# EAGLE schematic Main (EAGLE 9.5.1)

## Sheet 1 of 2
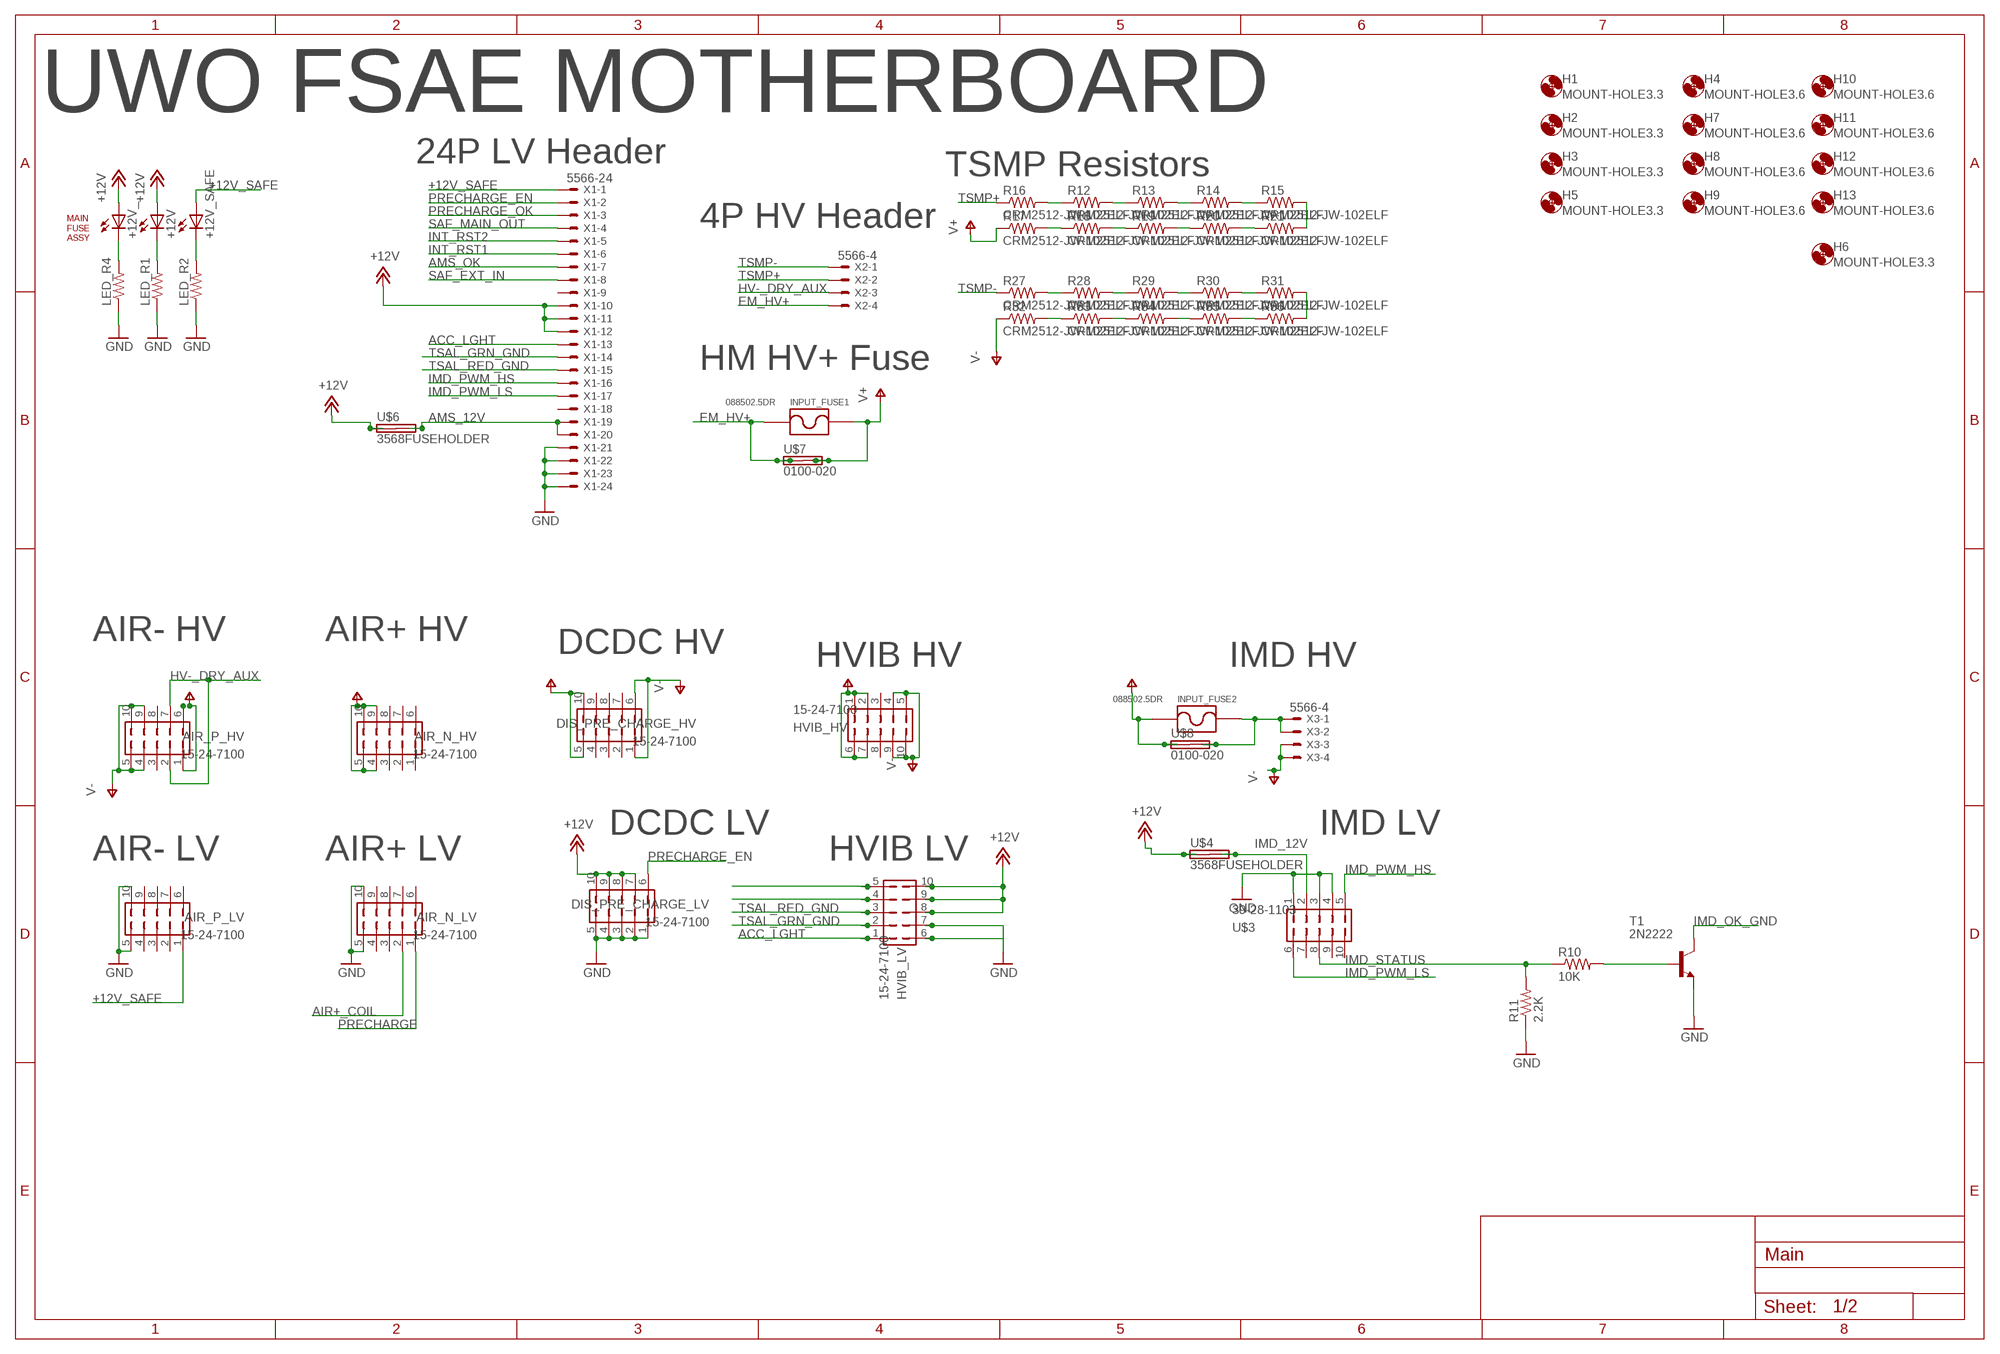
[diagram p0: schematic, sheet 1]

### Parts
+12V  LED3MM  [LED3MM]
+12V_  LED3MM  [LED3MM]
+12V_SAFE  LED3MM  [LED3MM]
AIR_N_HV  15-24-7100  [5566-10-BMI]
AIR_N_LV  15-24-7100  [5566-10-BMI]
AIR_P_HV  15-24-7100  [5566-10-BMI]
AIR_P_LV  15-24-7100  [5566-10-BMI]
DIS_PRE_CHARGE_HV  15-24-7100  [5566-10-BMI]
DIS_PRE_CHARGE_LV  15-24-7100  [5566-10-BMI]
H1  MOUNT-HOLE3.3  [3,3]
H2  MOUNT-HOLE3.3  [3,3]
H3  MOUNT-HOLE3.3  [3,3]
H4  MOUNT-HOLE3.6  [3,6]
H5  MOUNT-HOLE3.3  [3,3]
H6  MOUNT-HOLE3.3  [3,3]
H7  MOUNT-HOLE3.6  [3,6]
H8  MOUNT-HOLE3.6  [3,6]
H9  MOUNT-HOLE3.6  [3,6]
H10  MOUNT-HOLE3.6  [3,6]
H11  MOUNT-HOLE3.6  [3,6]
H12  MOUNT-HOLE3.6  [3,6]
H13  MOUNT-HOLE3.6  [3,6]
HVIB_HV  15-24-7100  [5566-10-BMI]
HVIB_LV  15-24-7100  [5566-10-BMI]
INPUT_FUSE1  088502.5DR  _CUSTOM_PARTS_LF_885  [_CUSTOM_PARTS_LF_885]
INPUT_FUSE2  088502.5DR  _CUSTOM_PARTS_LF_885  [_CUSTOM_PARTS_LF_885]
LED_R1  R-US_R0805  [R0805]
LED_R2  R-US_R0805  [R0805]
LED_R4  R-US_R0805  [R0805]
R10  10K  R-US_M0805  [M0805]
R11  2.2K  R-US_M0805  [M0805]
R12  CRM2512-JW-102ELF  R-US_R2512  [R2512]
R13  CRM2512-JW-102ELF  R-US_R2512  [R2512]
R14  CRM2512-JW-102ELF  R-US_R2512  [R2512]
R15  CRM2512-JW-102ELF  R-US_R2512  [R2512]
R16  CRM2512-JW-102ELF  R-US_R2512  [R2512]
R17  CRM2512-JW-102ELF  R-US_R2512  [R2512]
R18  CRM2512-JW-102ELF  R-US_R2512  [R2512]
R19  CRM2512-JW-102ELF  R-US_R2512  [R2512]
R20  CRM2512-JW-102ELF  R-US_R2512  [R2512]
R21  CRM2512-JW-102ELF  R-US_R2512  [R2512]
R27  CRM2512-JW-102ELF  R-US_R2512  [R2512]
R28  CRM2512-JW-102ELF  R-US_R2512  [R2512]
R29  CRM2512-JW-102ELF  R-US_R2512  [R2512]
R30  CRM2512-JW-102ELF  R-US_R2512  [R2512]
R31  CRM2512-JW-102ELF  R-US_R2512  [R2512]
R32  CRM2512-JW-102ELF  R-US_R2512  [R2512]
R33  CRM2512-JW-102ELF  R-US_R2512  [R2512]
R34  CRM2512-JW-102ELF  R-US_R2512  [R2512]
R35  CRM2512-JW-102ELF  R-US_R2512  [R2512]
R36  CRM2512-JW-102ELF  R-US_R2512  [R2512]
T1  2N2222  [TO92-EBC-OVAL]
U$1  MAINFUSEASSY  [MAINFUSEASSY]
U$3  39-28-1103  [39-28-1103]
U$4  3568FUSEHOLDER  [3568]
U$6  3568FUSEHOLDER  [3568]
U$7  0100-020  [0100-020]
U$8  0100-020  [0100-020]
X1  5566-24  [5566-24]
X2  5566-4  [5566-4]
X3  5566-4  [5566-4]

### Nets
+12V: +12V.A +12V_.A DIS_PRE_CHARGE_LV.7 DIS_PRE_CHARGE_LV.8 DIS_PRE_CHARGE_LV.9 DIS_PRE_CHARGE_LV.10 HVIB_LV.8 HVIB_LV.9 HVIB_LV.10 U$4.L1(1A) U$4.L2(1B) U$6.L1(1A) U$6.L2(1B) X1.10 X1.11 X1.12 ; also sheet 2
+12V_SAFE: +12V_SAFE.A AIR_P_LV.1 X1.1 ; also sheet 2
ACC_LGHT: HVIB_LV.1 X1.13
AIR+_COIL: AIR_N_LV.2 ; also sheet 2
AMS_12V: U$6.R1(2A) U$6.R2(2B) X1.19 X1.20
AMS_OK: X1.7 ; also sheet 2
EM_HV+ [HV]: INPUT_FUSE1.P$1 U$7.P$1(1A) U$7.P$3(1B) X2.4
GND: AIR_N_LV.5 AIR_N_LV.10 AIR_P_LV.5 AIR_P_LV.10 DIS_PRE_CHARGE_LV.1 DIS_PRE_CHARGE_LV.2 DIS_PRE_CHARGE_LV.3 DIS_PRE_CHARGE_LV.4 DIS_PRE_CHARGE_LV.5 HVIB_LV.7 LED_R1.1 LED_R2.1 LED_R4.1 R11.1 T1.E U$3.1 U$3.3 U$3.4 X1.21 X1.22 X1.23 X1.24 ; also sheet 2
HV-_DRY_AUX [HV]: AIR_P_HV.2 AIR_P_HV.7 X2.3
IMD_12V: U$3.2 U$4.R1(2A) U$4.R2(2B)
IMD_OK_GND: T1.C ; also sheet 2
IMD_PWM_HS: U$3.5 X1.16
IMD_PWM_LS: U$3.6 X1.17
IMD_STATUS: R10.1 R11.2 U$3.8
INT_RST1: X1.6 ; also sheet 2
INT_RST2: X1.5 ; also sheet 2
N$1: HVIB_LV.6
N$2: +12V.K(C) LED_R1.2
N$3: R10.2 T1.B
N$5: +12V_.K(C) LED_R4.2
N$6: +12V_SAFE.K(C) LED_R2.2
N$10: R12.1 R16.2
N$12: HVIB_LV.4
N$16: HVIB_LV.5
N$17: R12.2 R13.1
N$18: R13.2 R14.1
N$19: R14.2 R15.1
N$20 [HV]: R15.2 R21.2
N$21 [HV]: R20.2 R21.1
N$22 [HV]: R19.2 R20.1
N$23 [HV]: R18.2 R19.1
N$24 [HV]: R17.2 R18.1
N$26: INPUT_FUSE2.P$2 U$8.P$2(2A) U$8.P$4(2B) X3.1 X3.2
N$32 [HV]: R27.2 R28.1
N$33 [HV]: R28.2 R29.1
N$34 [HV]: R29.2 R30.1
N$35 [HV]: R30.2 R31.1
N$36 [HV]: R31.2 R36.2
N$37 [HV]: R35.2 R36.1
N$38 [HV]: R34.2 R35.1
N$39 [HV]: R33.2 R34.1
N$40 [HV]: R32.2 R33.1
PRECHARGE: AIR_N_LV.1 ; also sheet 2
PRECHARGE_EN: DIS_PRE_CHARGE_LV.6 X1.2 ; also sheet 2
PRECHARGE_OK: X1.3 ; also sheet 2
SAF_EXT_IN: X1.8 ; also sheet 2
SAF_MAIN_OUT: X1.4 ; also sheet 2
TSAL_GRN_GND: HVIB_LV.2 X1.14
TSAL_RED_GND: HVIB_LV.3 X1.15
TSMP+ [HV]: R16.1 X2.2
TSMP- [HV]: R27.1 X2.1
V+ [HV]: AIR_N_HV.4 AIR_N_HV.5 AIR_N_HV.9 AIR_N_HV.10 AIR_P_HV.1 AIR_P_HV.6 DIS_PRE_CHARGE_HV.5 DIS_PRE_CHARGE_HV.10 HVIB_HV.1 HVIB_HV.2 HVIB_HV.6 HVIB_HV.7 INPUT_FUSE1.P$2 INPUT_FUSE2.P$1 R17.1 U$7.P$2(2A) U$7.P$4(2B) U$8.P$1(1A) U$8.P$3(1B)
V- [HV]: AIR_P_HV.4 AIR_P_HV.5 AIR_P_HV.9 AIR_P_HV.10 DIS_PRE_CHARGE_HV.1 DIS_PRE_CHARGE_HV.6 HVIB_HV.4 HVIB_HV.5 HVIB_HV.9 HVIB_HV.10 R32.1 X3.3 X3.4
Unconnected: AIR_N_HV.1 AIR_N_HV.2 AIR_N_HV.3 AIR_N_HV.6 AIR_N_HV.7 AIR_N_HV.8 AIR_N_LV.3 AIR_N_LV.4 AIR_N_LV.6 AIR_N_LV.7 AIR_N_LV.8 AIR_N_LV.9 AIR_P_HV.3 AIR_P_HV.8 AIR_P_LV.2 AIR_P_LV.3 AIR_P_LV.4 AIR_P_LV.6 AIR_P_LV.7 AIR_P_LV.8 AIR_P_LV.9 DIS_PRE_CHARGE_HV.2 DIS_PRE_CHARGE_HV.3 DIS_PRE_CHARGE_HV.4 DIS_PRE_CHARGE_HV.7 DIS_PRE_CHARGE_HV.8 DIS_PRE_CHARGE_HV.9 HVIB_HV.3 HVIB_HV.8 U$3.7 U$3.9 U$3.10 X1.9 X1.18

### Notes on the sheet
- UWO FSAE MOTHERBOARD
- 24P LV Header
- TSMP Resistors
- 4P HV Header
- HM HV+ Fuse
- AIR- HV | AIR+ HV
- DCDC HV
- HVIB HV | IMD HV
- DCDC LV | IMD LV
- AIR- LV | AIR+ LV | HVIB LV

## Sheet 2 of 2
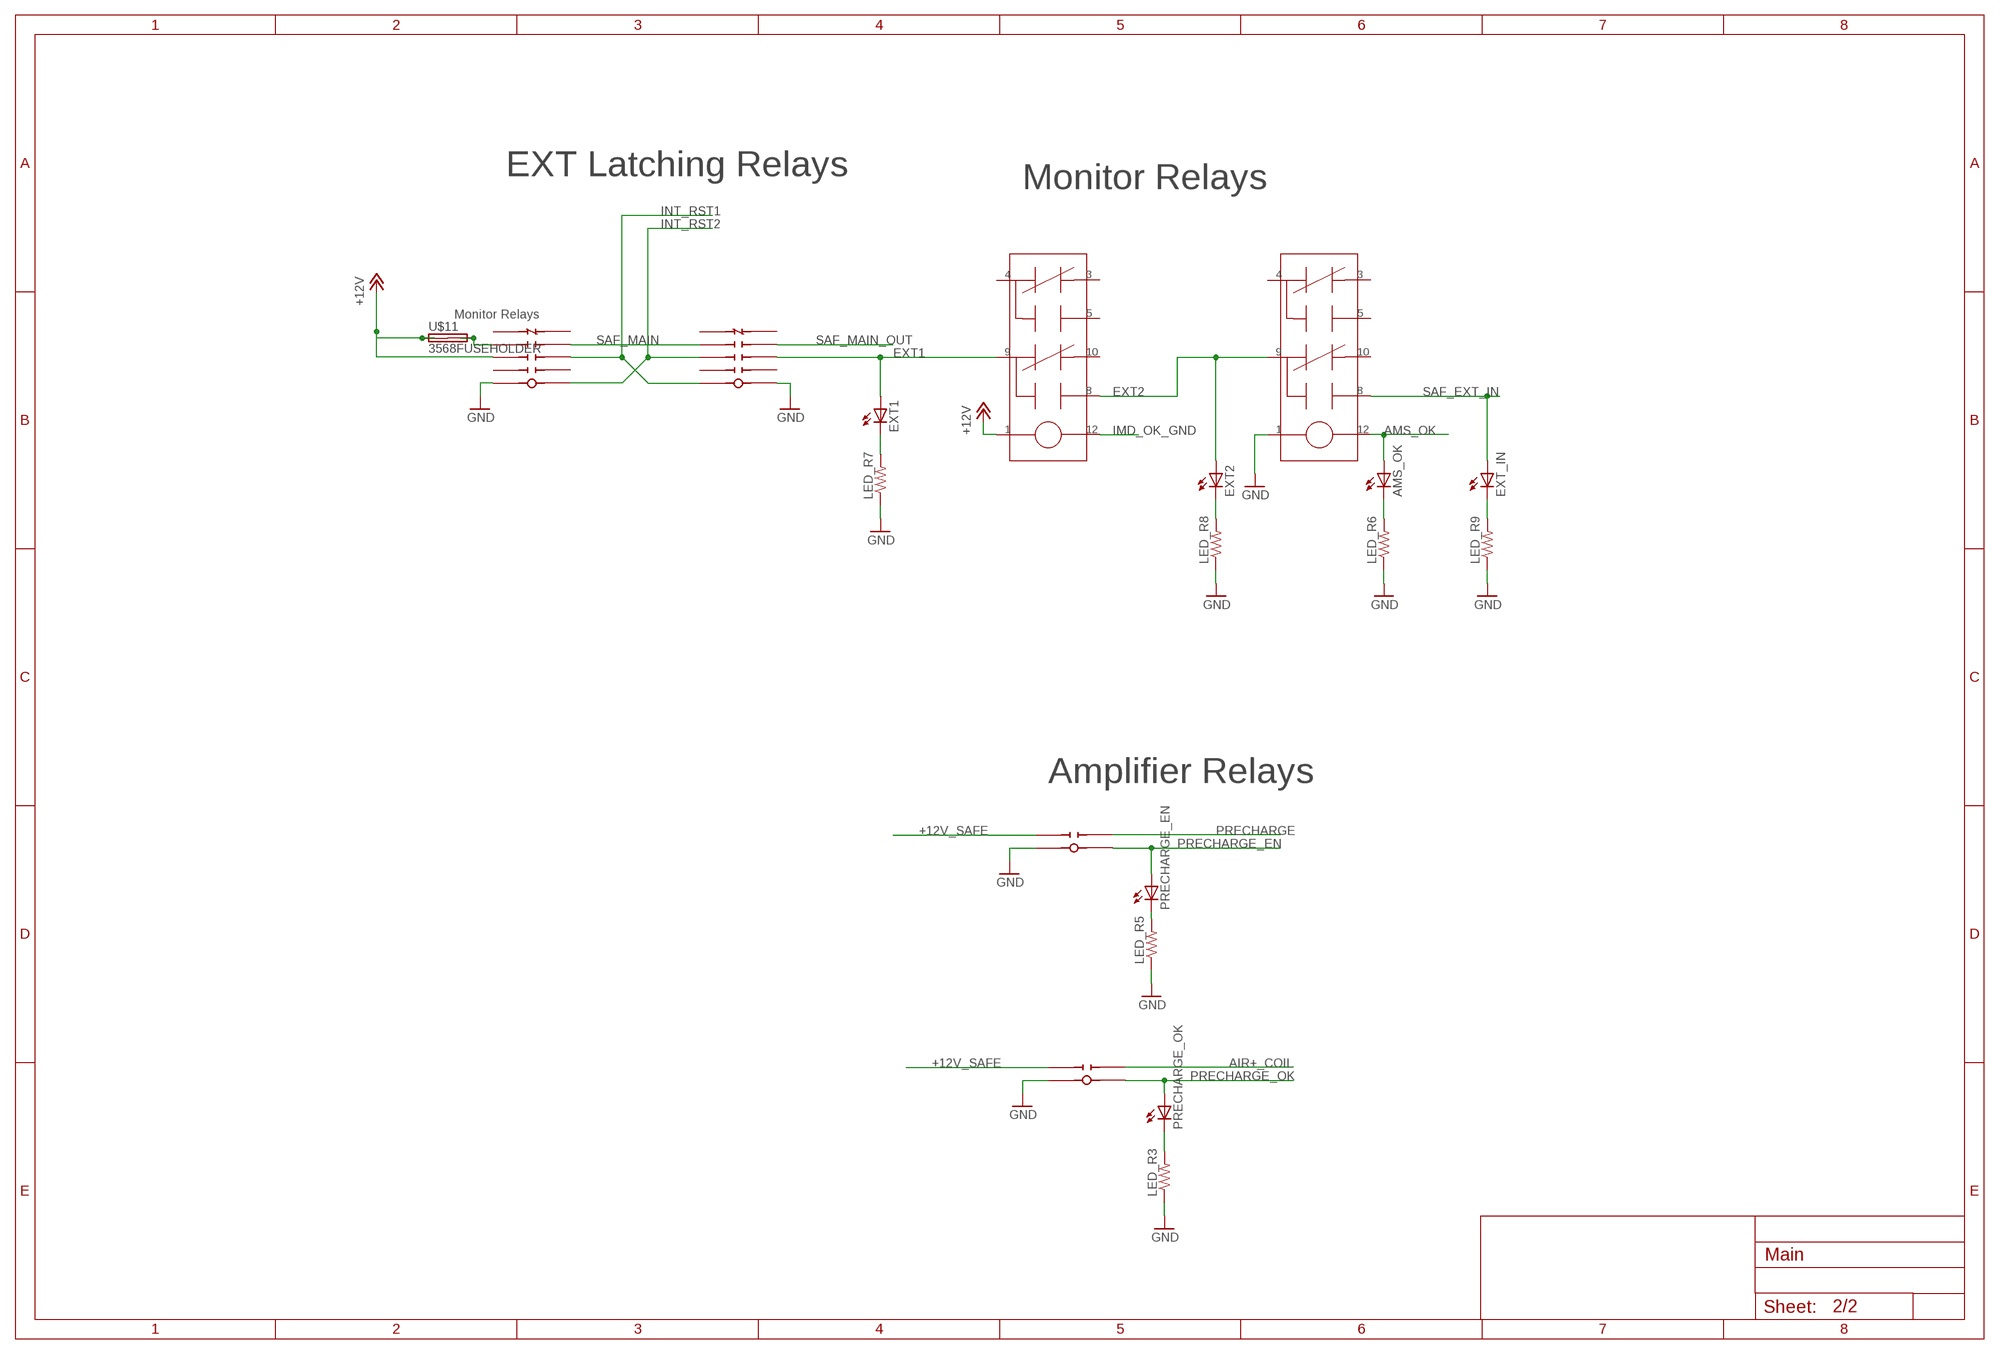
[diagram p1: schematic, sheet 2]

### Parts
AMS_OK  LED3MM  [LED3MM]
EXT1  LED3MM  [LED3MM]
EXT2  LED3MM  [LED3MM]
EXT_IN  LED3MM  [LED3MM]
LED_R3  R-US_R0805  [R0805]
LED_R5  R-US_R0805  [R0805]
LED_R6  R-US_R0805  [R0805]
LED_R7  R-US_R0805  [R0805]
LED_R8  R-US_R0805  [R0805]
LED_R9  R-US_R0805  [R0805]
PRECHARGE_EN  LED3MM  [LED3MM]
PRECHARGE_OK  LED3MM  [LED3MM]
U$2  SR4M4012_TE  [SR4M4012_FOOT]
U$5  SR4M4012_TE  [SR4M4012_FOOT]
U$9  G5NB-1A-E  [G5NB-1A-E]
U$10  G5NB-1A-E  [G5NB-1A-E]
U$11  3568FUSEHOLDER  [3568]
U$12  V23079B1203B301  [V23079B1203B301]
U$13  V23079B1203B301  [V23079B1203B301]

### Nets
+12V: U$2.NOA2 U$11.L1(1A) U$11.L2(1B) U$12.1 ; also sheet 1
+12V_SAFE: U$9.2(NOA1) U$10.2(NOA1) ; also sheet 1
AIR+_COIL: U$9.3(NOB1) ; also sheet 1
AMS_OK: AMS_OK.A U$13.12 ; also sheet 1
EXT1: EXT1.A U$5.NOB2 U$12.9
EXT2: EXT2.A U$12.8 U$13.9
GND: LED_R3.1 LED_R5.1 LED_R6.1 LED_R7.1 LED_R8.1 LED_R9.1 U$2.COIL+ U$5.COIL- U$9.1(COIL+) U$10.1(COIL+) U$13.1 ; also sheet 1
IMD_OK_GND: U$12.12 ; also sheet 1
INT_RST1: U$2.NOB2 U$5.COIL+ ; also sheet 1
INT_RST2: U$2.COIL- U$5.NOA2 ; also sheet 1
N$4: U$2.NOA3 U$11.R1(2A) U$11.R2(2B)
N$7: LED_R5.2 PRECHARGE_EN.K(C)
N$8: LED_R3.2 PRECHARGE_OK.K(C)
N$11: AMS_OK.K(C) LED_R6.2
N$13: EXT1.K(C) LED_R7.2
N$14: EXT2.K(C) LED_R8.2
N$15: EXT_IN.K(C) LED_R9.2
PRECHARGE: U$10.3(NOB1) ; also sheet 1
PRECHARGE_EN: PRECHARGE_EN.A U$10.4(COIL-) ; also sheet 1
PRECHARGE_OK: PRECHARGE_OK.A U$9.4(COIL-) ; also sheet 1
SAF_EXT_IN: EXT_IN.A U$13.8 ; also sheet 1
SAF_MAIN: U$2.NOB3 U$5.NOA3
SAF_MAIN_OUT: U$5.NOB3 ; also sheet 1
Unconnected: U$2.NCA4 U$2.NCB4 U$2.NOA1 U$2.NOB1 U$5.NCA4 U$5.NCB4 U$5.NOA1 U$5.NOB1 U$12.3 U$12.4 U$12.5 U$12.10 U$13.3 U$13.4 U$13.5 U$13.10

### Notes on the sheet
- EXT Latching Relays
- Monitor Relays
- Monitor Relays
- Amplifier Relays

## Library data of the parts
+12V +12V_ +12V_SAFE AMS_OK EXT1 EXT2 EXT_IN PRECHARGE_EN PRECHARGE_OK = ACC-MB-R0:LED: LED OSRAM: - CHIPLED LG R971, LG N971, LY N971, LG Q971, LY Q971, LO R971, LY R971 LH N974, LH R974 LS Q976, LO Q976, LY Q976 LO Q996 - Hyper CHIPLED LW Q18S LB Q993, LB Q99A, LB R99A - SideLED LS A670, LO A670, LY A670, LG A670, LP A670 LB A673, LV A673, LT A673, LW A673 LH A674 LY A675 LS A676, LA A676, LO A676, LY A676, LW A676 LS A679, LY A679, LG A679 - Hyper Micro SIDELED® LS Y876, LA Y876, LO Y876, LY Y876 LT Y87S - SmartLED LW L88C, LW L88S LB L89C, LB L89S, LG L890 LS L89K, LO L89K, LY L89K LS L896, LA L896, LO L896, LY L896 - TOPLED LS T670, LO T670, LY T670, LG T670, LP T670 LSG T670, LSP T670, LSY T670, LOP T670, LYG T670 LG T671, LOG T671, LSG T671 LB T673, LV T673, LT T673, LW T673 LH T674 LS T676, LA T676, LO T676, LY T676, LB T676, LH T676, LSB T676, LW T676 LB T67C, LV T67C, LT T67C, LS T67K, LO T67K, LY T67K, LW E67C LS E67B, LA E67B, LO E67B, LY E67B, LB E67C, LV E67C, LT E67C LW T67C LS T679, LY T679, LG T679 LS T770, LO T770, LY T770, LG T770, LP T770 LB T773, LV T773, LT T773, LW T773 LH T774 LS E675, LA E675, LY E675, LS T675 LS T776, LA T776, LO T776, LY T776, LB T776 LHGB T686 LT T68C, LB T68C - Hyper Mini TOPLED® LB M676 - Mini TOPLED Santana® LG M470 LS M47K, LO M47K, LY M47K Source: http://www.osram.convergy.de LUXEON: - LUMILED® LXK2-PW12-R00, LXK2-PW12-S00, LXK2-PW14-U00, LXK2-PW14-V00 LXK2-PM12-R00, LXK2-PM12-S00, LXK2-PM14-U00 LXK2-PE12-Q00, LXK2-PE12-R00, LXK2-PE12-S00, LXK2-PE14-T00, LXK2-PE14-U00 LXK2-PB12-K00, LXK2-PB12-L00, LXK2-PB12-M00, LXK2-PB14-N00, LXK2-PB14-P00, LXK2-PB14-Q00 LXK2-PR12-L00, LXK2-PR12-M00, LXK2-PR14-Q00, LXK2-PR14-R00 LXK2-PD12-Q00, LXK2-PD12-R00, LXK2-PD12-S00 LXK2-PH12-R00, LXK2-PH12-S00 LXK2-PL12-P00, LXK2-PL12-Q00, LXK2-PL12-R00 Source: www.luxeon.com KINGBRIGHT: KA-3528ASYC Source: www.kingbright.com
AIR_N_HV AIR_N_LV AIR_P_HV AIR_P_LV DIS_PRE_CHARGE_HV DIS_PRE_CHARGE_LV HVIB_HV HVIB_LV = ACC-MB-R0:15-24-7100
H1-H13 = ACC-MB-R0:MOUNT-HOLE: MOUNTING HOLE with drill center marker
INPUT_FUSE1 INPUT_FUSE2 = ACC-MB-R0:_CUSTOM_PARTS_LF_885
LED_R1-LED_R9 R10-R21 R27-R36 = ACC-MB-R0:R-US_: RESISTOR, American symbol; SPICEPREFIX: R
T1 = adafruit:2N2222: NPN TRANSISTOR Big oval pads
U$1 = ACC-MB-R0:MAINFUSEASSY
U$2 U$5 = ACC-MB-R0:SR4M4012_TE
U$3 = ACC-MB-R0:39-28-1103
U$4 U$6 U$11 = ACC-MB-R0:3568FUSEHOLDER: 3568 20AMP 500VAC
U$7 U$8 = ACC-MB-R0:0100-020
U$9 U$10 = ACC-MB-R0:G5NB-1A-E
U$12 U$13 = ACC-MB-R0:V23079B1203B301
X1 = ACC-MB-R0:5566-24: Mini FIT connector 24 pol Source: http://www.molex.com; MF: MOLEX; OC_FARNELL: unknown; OC_NEWARK: unknown
X2 X3 = ACC-MB-R0:5566-4: Mini FIT connector 4 pol Source: http://www.molex.com; MF: MOLEX; OC_FARNELL: unknown; OC_NEWARK: unknown

## Net classes
0 default: width 0.2 mm, clearance 0.2 mm
2 HV: width 1.27 mm, clearance 1.5 mm to class 0, clearance 1.5 mm to class 1, clearance 1.5 mm